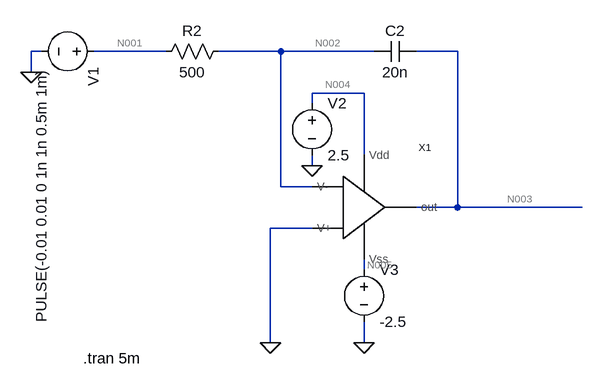
[diagram p0: schematic 3b.asc]
3b.asc, the LTspice schematic file:
Version 4
SHEET 1 880 680
WIRE -288 -96 -304 -96
WIRE -96 -96 -208 -96
WIRE 80 -96 -16 -96
WIRE 224 -96 80 -96
WIRE 352 -96 288 -96
WIRE -304 -64 -304 -96
WIRE 208 -32 128 -32
WIRE 128 -16 128 -32
WIRE 208 64 208 -32
WIRE 128 80 128 64
WIRE 80 112 80 -96
WIRE 128 112 80 112
WIRE 352 144 352 -96
WIRE 352 144 288 144
WIRE 544 144 352 144
WIRE 128 176 64 176
WIRE 208 240 208 224
WIRE 64 352 64 176
WIRE 208 352 208 320
FLAG 64 352 0
FLAG 208 352 0
FLAG 128 80 0
FLAG -304 -64 0
SYMBOL voltage -192 -96 R90
WINDOW 123 0 0 Left 0
WINDOW 39 0 0 Left 0
SYMATTR InstName V1
SYMATTR Value PULSE(-0.01 0.01 0 1n 1n 0.5m 1m)
SYMBOL voltage 128 -32 R0
WINDOW 123 0 0 Left 0
WINDOW 39 0 0 Left 0
SYMATTR InstName V2
SYMATTR Value 2.5
SYMBOL voltage 208 224 R0
WINDOW 123 0 0 Left 0
WINDOW 39 0 0 Left 0
SYMATTR InstName V3
SYMATTR Value -2.5
SYMBOL OPAMP 96 144 R0
SYMATTR InstName X1
SYMBOL cap 288 -112 R90
WINDOW 0 0 32 VBottom 2
WINDOW 3 32 32 VTop 2
SYMATTR InstName C2
SYMATTR Value 20n
SYMBOL res 0 -112 R90
WINDOW 0 0 56 VBottom 2
WINDOW 3 32 56 VTop 2
SYMATTR InstName R2
SYMATTR Value 500
TEXT -224 376 Left 2 !.tran 5m

The netlist it stands for:
* 3b.asc
V1 N001 0 PULSE(-0.01 0.01 0 1n 1n 0.5m 1m)
V2 N004 0 2.5
V3 N005 0 -2.5
XX1 N004 N005 N002 0 N003 OPAMP  ; pins Vdd Vss V- V+ out
C2 N003 N002 20n
R2 N002 N001 500
.tran 5m
.backanno
.end

* Results of the author's LTspice run, read from the files saved beside the schematic
* Operating Point, zero values left out:
*   V(n001) = -10 mV
*   V(n004) = 2.5 V
*   V(n005) = -2.5 V
*   V(n002) = -10 mV
*   V(n003) = 2.481 V
*   I(V2) = -199.9 µA
*   I(V3) = 199.9 µA
*   Ix(x1:VDD) = 199.9 µA
*   Ix(x1:VSS) = -199.9 µA
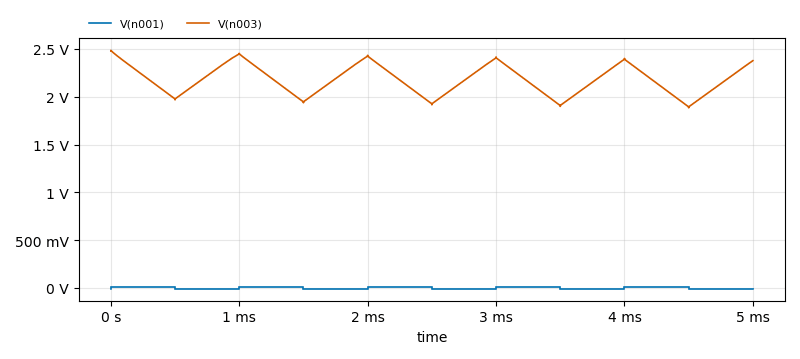
[diagram p1: Transient Analysis of 3b.asc, plotted from the saved traces]
* Transient Analysis, 1 run:
*   V(n001): min -10 mV, max 10 mV, average 20 nV, rms 10 mV, last -10 mV
*   V(n003): min 1.884 V, max 2.485 V, average 2.176 V, rms 2.184 V, last 2.378 V